# Altium schematic sheet 30-FT4232 LEVEL TRANSLATOR.SchDoc
size 513 x 386 mm
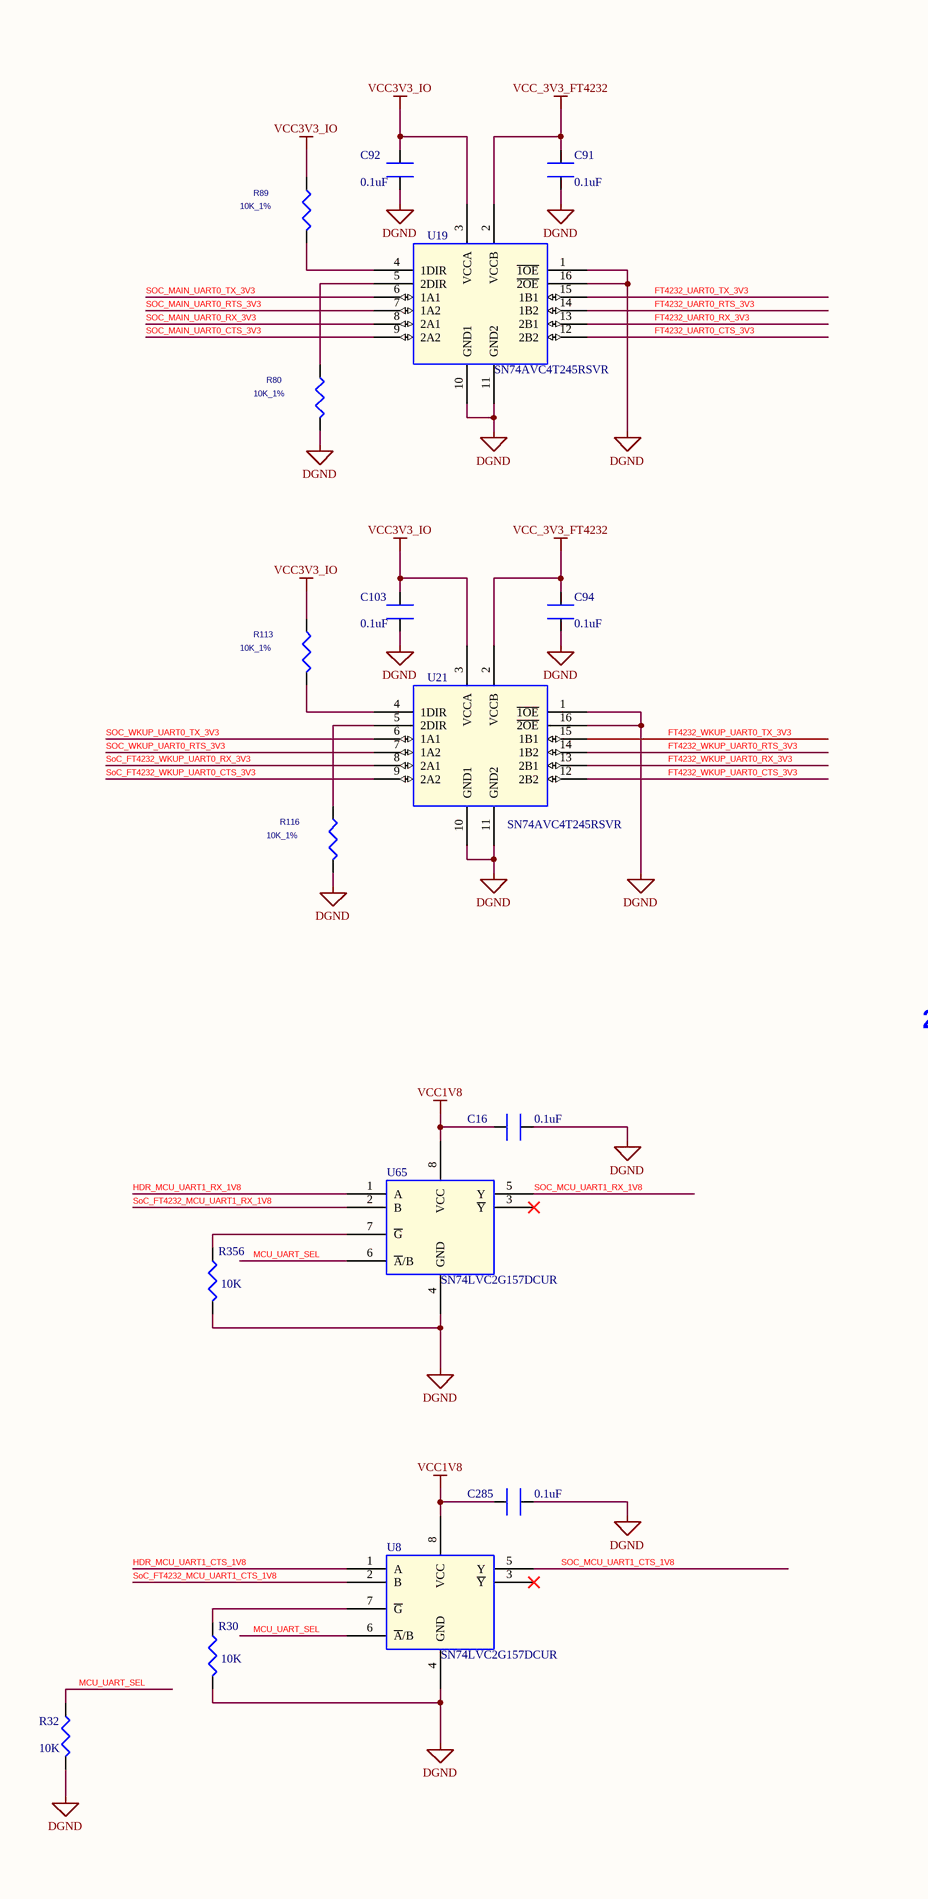
[diagram p0: 30-FT4232 LEVEL TRANSLATOR.SchDoc, left]
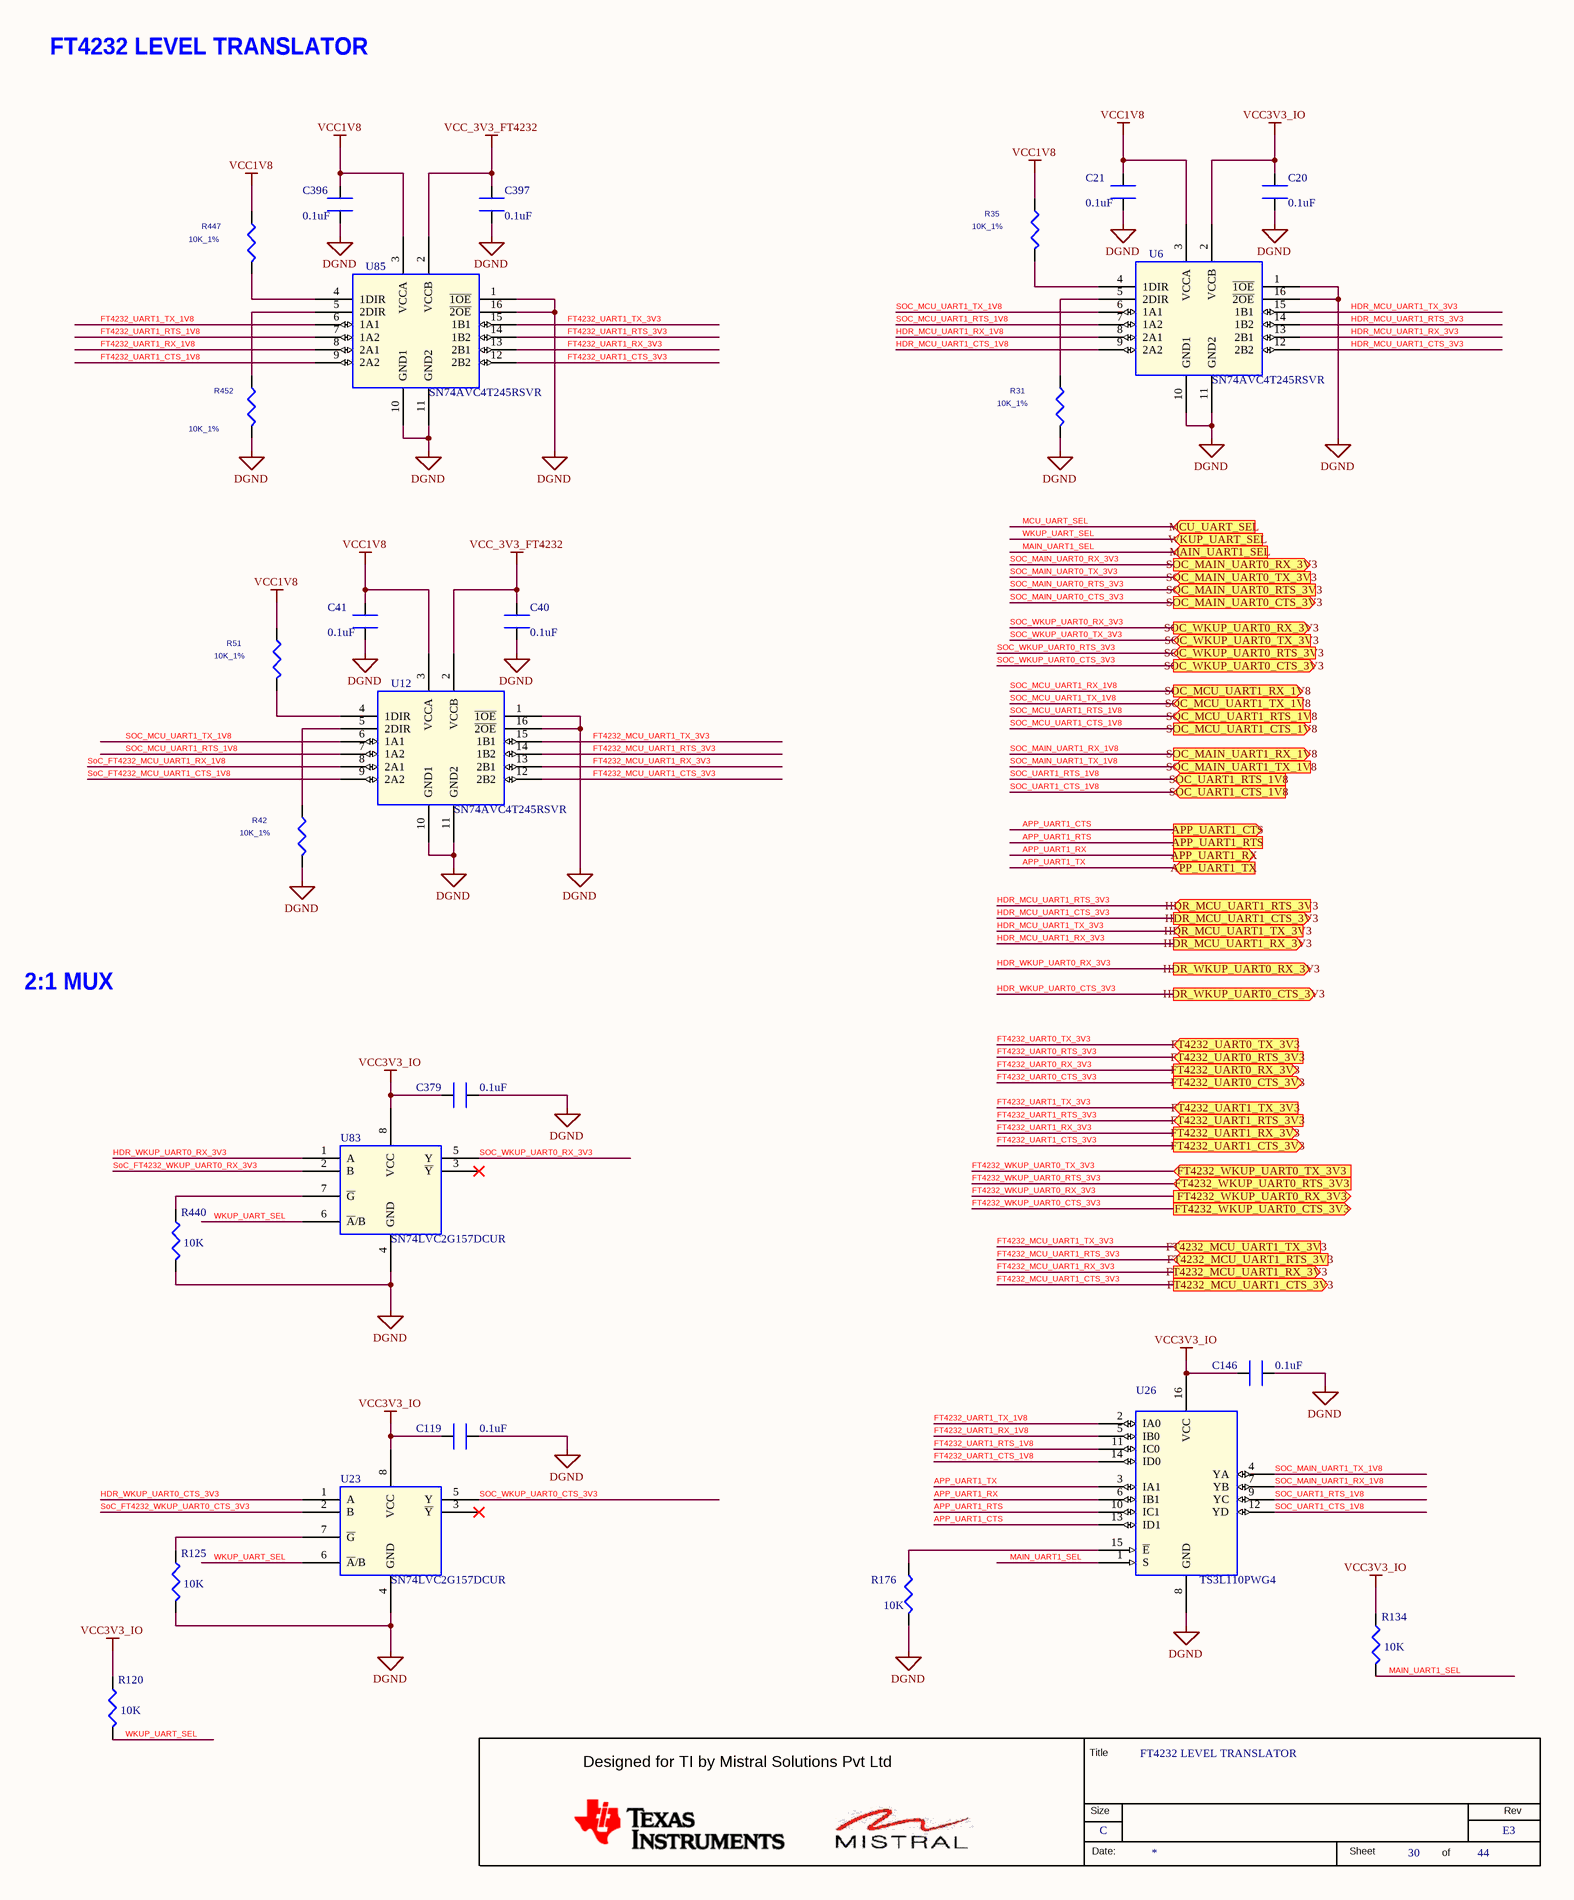
[diagram p1: 30-FT4232 LEVEL TRANSLATOR.SchDoc, right]

## Parts
*  RevCode: E3  Title: FT4232 LEVEL TRANSLATOR  Page Size: C  Page Number: 30  Page Count: 44  (hidden comment: MISTRAL_TITLEBLK_CSIZE)  (graphical)
C16  0.1uF  [CAP0201_0-5]
C20  0.1uF  [CAP0201_0-5]
C21  0.1uF  [CAP0201_0-5]
C40  0.1uF  [CAP0201_0-5]
C41  0.1uF  [CAP0201_0-5]
C91  0.1uF  [CAP0201_0-5]
C92  0.1uF  [CAP0201_0-5]
C94  0.1uF  [CAP0201_0-5]
C103  0.1uF  [CAP0201_0-5]
C119  0.1uF  [CAP0201_0-5]
C146  0.1uF  [CAP0201_0-5]
C285  0.1uF  [CAP0201_0-5]
C379  0.1uF  [CAP0201_0-5]
C396  0.1uF  [CAP0201_0-5]
C397  0.1uF  [CAP0201_0-5]
R30  10K  [RES0402_0-5]
R31  10K_1%  [RES0402_0-5]
R32  10K  [RES0402_0-5]
R35  10K_1%  [RES0402_0-5]
R42  10K_1%  [RES0402_0-5]
R51  10K_1%  [RES0402_0-5]
R80  10K_1%  [RES0402_0-5]
R89  10K_1%  [RES0402_0-5]
R113  10K_1%  [RES0402_0-5]
R116  10K_1%  [RES0402_0-5]
R120  10K  [RES0402_0-5]
R125  10K  [RES0402_0-5]
R134  10K  [RES0402_0-5]
R176  10K  [RES0402_0-5]
R356  10K  [RES0402_0-5]
R440  10K  [RES0402_0-5]
R447  10K_1%  [RES0402_0-5]
R452  10K_1%  [RES0402_0-5]
U6  SN74AVC4T245RSVR  [UQFN16_15-74_105X75_0-6]
U8  SN74LVC2G157DCUR  [VSSOP8_19-68_85X95_0-9]
U12  SN74AVC4T245RSVR  [UQFN16_15-74_105X75_0-6]
U19  SN74AVC4T245RSVR  [UQFN16_15-74_105X75_0-6]
U21  SN74AVC4T245RSVR  [UQFN16_15-74_105X75_0-6]
U23  SN74LVC2G157DCUR  [VSSOP8_19-68_85X95_0-9]
U26  TS3L110PWG4  [TSSOP16_25-59_205X180]
U65  SN74LVC2G157DCUR  [VSSOP8_19-68_85X95_0-9]
U83  SN74LVC2G157DCUR  [VSSOP8_19-68_85X95_0-9]
U85  SN74AVC4T245RSVR  [UQFN16_15-74_105X75_0-6]

## Ports
APP_UART1_CTS (out), APP_UART1_RTS, APP_UART1_RX (out), APP_UART1_TX (in), FT4232_MCU_UART1_CTS_3V3 (out), FT4232_MCU_UART1_RTS_3V3 (in), FT4232_MCU_UART1_RX_3V3 (out), FT4232_MCU_UART1_TX_3V3 (in), FT4232_UART0_CTS_3V3 (out), FT4232_UART0_RTS_3V3 (in), FT4232_UART0_RX_3V3 (out), FT4232_UART0_TX_3V3 (in), FT4232_UART1_CTS_3V3 (out), FT4232_UART1_RTS_3V3 (in), FT4232_UART1_RX_3V3 (out), FT4232_UART1_TX_3V3 (in), FT4232_WKUP_UART0_CTS_3V3 (out), FT4232_WKUP_UART0_RTS_3V3 (in), FT4232_WKUP_UART0_RX_3V3 (out), FT4232_WKUP_UART0_TX_3V3 (in), HDR_MCU_UART1_CTS_3V3 (out), HDR_MCU_UART1_RTS_3V3 (in), HDR_MCU_UART1_RX_3V3 (out), HDR_MCU_UART1_TX_3V3 (in), HDR_WKUP_UART0_CTS_3V3 (out), HDR_WKUP_UART0_RX_3V3 (out), MAIN_UART1_SEL (in), MCU_UART_SEL (in), SOC_MAIN_UART0_CTS_3V3 (out), SOC_MAIN_UART0_RTS_3V3 (in), SOC_MAIN_UART0_RX_3V3 (out), SOC_MAIN_UART0_TX_3V3 (in), SOC_MAIN_UART1_RX_1V8 (out), SOC_MAIN_UART1_TX_1V8 (in), SOC_MCU_UART1_CTS_1V8 (out), SOC_MCU_UART1_RTS_1V8 (in), SOC_MCU_UART1_RX_1V8 (out), SOC_MCU_UART1_TX_1V8 (in), SOC_UART1_CTS_1V8 (in), SOC_UART1_RTS_1V8 (in), SOC_WKUP_UART0_CTS_3V3 (out), SOC_WKUP_UART0_RTS_3V3 (in), SOC_WKUP_UART0_RX_3V3 (out), SOC_WKUP_UART0_TX_3V3 (in), WKUP_UART_SEL (in)

## Nets
DGND: C16.2 C20.2 C21.2 C40.2 C41.2 C91.2 C92.2 C94.2 C103.2 C119.2 C146.2 C285.2 C379.2 C396.2 C397.2 R30.2 R31.1 R32.2 R42.1 R80.1 R116.1 R125.2 R176.2 R356.2 R440.2 R452.1 U6.1(~{1OE}) U6.10(GND1) U6.11(GND2) U6.16(~{2OE}) U8.4(GND) U12.1(~{1OE}) U12.10(GND1) U12.11(GND2) U12.16(~{2OE}) U19.1(~{1OE}) U19.10(GND1) U19.11(GND2) U19.16(~{2OE}) U21.1(~{1OE}) U21.10(GND1) U21.11(GND2) U21.16(~{2OE}) U23.4(GND) U26.8(GND) U65.4(GND) U83.4(GND) U85.1(~{1OE}) U85.10(GND1) U85.11(GND2) U85.16(~{2OE})
VCC1V8: C16.1 C21.1 C41.1 C285.1 C396.1 R35.2 R51.2 R447.2 U6.3(VCCA) U8.8(VCC) U12.3(VCCA) U65.8(VCC) U85.3(VCCA)
VCC3V3_IO: C20.1 C92.1 C103.1 C119.1 C146.1 C379.1 R89.2 R113.2 R120.1 R134.1 U6.2(VCCB) U19.3(VCCA) U21.3(VCCA) U23.8(VCC) U26.16(VCC) U83.8(VCC)
VCC_3V3_FT4232: C40.1 C91.1 C94.1 C397.1 U12.2(VCCB) U19.2(VCCB) U21.2(VCCB) U85.2(VCCB)
APP_UART1_CTS: U26.13(ID1) ; port APP_UART1_CTS
APP_UART1_RTS: U26.10(IC1) ; port APP_UART1_RTS
APP_UART1_RX: U26.6(IB1) ; port APP_UART1_RX
APP_UART1_TX: U26.3(IA1) ; port APP_UART1_TX
FT4232_MCU_UART1_CTS_3V3: U12.12(2B2) ; port FT4232_MCU_UART1_CTS_3V3
FT4232_MCU_UART1_RTS_3V3: U12.14(1B2) ; port FT4232_MCU_UART1_RTS_3V3
FT4232_MCU_UART1_RX_3V3: U12.13(2B1) ; port FT4232_MCU_UART1_RX_3V3
FT4232_MCU_UART1_TX_3V3: U12.15(1B1) ; port FT4232_MCU_UART1_TX_3V3
FT4232_UART0_CTS_3V3: U19.12(2B2) ; port FT4232_UART0_CTS_3V3
FT4232_UART0_RTS_3V3: U19.14(1B2) ; port FT4232_UART0_RTS_3V3
FT4232_UART0_RX_3V3: U19.13(2B1) ; port FT4232_UART0_RX_3V3
FT4232_UART0_TX_3V3: U19.15(1B1) ; port FT4232_UART0_TX_3V3
FT4232_UART1_CTS_1V8: U26.14(ID0) U85.9(2A2)
FT4232_UART1_CTS_3V3: U85.12(2B2) ; port FT4232_UART1_CTS_3V3
FT4232_UART1_RTS_1V8: U26.11(IC0) U85.7(1A2)
FT4232_UART1_RTS_3V3: U85.14(1B2) ; port FT4232_UART1_RTS_3V3
FT4232_UART1_RX_1V8: U26.5(IB0) U85.8(2A1)
FT4232_UART1_RX_3V3: U85.13(2B1) ; port FT4232_UART1_RX_3V3
FT4232_UART1_TX_1V8: U26.2(IA0) U85.6(1A1)
FT4232_UART1_TX_3V3: U85.15(1B1) ; port FT4232_UART1_TX_3V3
FT4232_WKUP_UART0_CTS_3V3: U21.12(2B2) ; port FT4232_WKUP_UART0_CTS_3V3
FT4232_WKUP_UART0_RTS_3V3: U21.14(1B2) ; port FT4232_WKUP_UART0_RTS_3V3
FT4232_WKUP_UART0_RX_3V3: U21.13(2B1) ; port FT4232_WKUP_UART0_RX_3V3
FT4232_WKUP_UART0_TX_3V3: U21.15(1B1) ; port FT4232_WKUP_UART0_TX_3V3
HDR_MCU_UART1_CTS_1V8: U6.9(2A2) U8.1(A)
HDR_MCU_UART1_CTS_3V3: U6.12(2B2) ; port HDR_MCU_UART1_CTS_3V3
HDR_MCU_UART1_RTS_3V3: U6.14(1B2) ; port HDR_MCU_UART1_RTS_3V3
HDR_MCU_UART1_RX_1V8: U6.8(2A1) U65.1(A)
HDR_MCU_UART1_RX_3V3: U6.13(2B1) ; port HDR_MCU_UART1_RX_3V3
HDR_MCU_UART1_TX_3V3: U6.15(1B1) ; port HDR_MCU_UART1_TX_3V3
HDR_WKUP_UART0_CTS_3V3: U23.1(A) ; port HDR_WKUP_UART0_CTS_3V3
HDR_WKUP_UART0_RX_3V3: U83.1(A) ; port HDR_WKUP_UART0_RX_3V3
MAIN_UART1_SEL: R134.2 U26.1(S) ; port MAIN_UART1_SEL
MCU_UART_SEL: R32.1 U8.6(~{A}/B) U65.6(~{A}/B) ; port MCU_UART_SEL
SoC_FT4232_MCU_UART1_CTS_1V8: U8.2(B) U12.9(2A2)
SoC_FT4232_MCU_UART1_RX_1V8: U12.8(2A1) U65.2(B)
SoC_FT4232_WKUP_UART0_CTS_3V3: U21.9(2A2) U23.2(B)
SoC_FT4232_WKUP_UART0_RX_3V3: U21.8(2A1) U83.2(B)
SOC_MAIN_UART0_CTS_3V3: U19.9(2A2) ; port SOC_MAIN_UART0_CTS_3V3
SOC_MAIN_UART0_RTS_3V3: U19.7(1A2) ; port SOC_MAIN_UART0_RTS_3V3
SOC_MAIN_UART0_RX_3V3: U19.8(2A1) ; port SOC_MAIN_UART0_RX_3V3
SOC_MAIN_UART0_TX_3V3: U19.6(1A1) ; port SOC_MAIN_UART0_TX_3V3
SOC_MAIN_UART1_RX_1V8: U26.7(YB) ; port SOC_MAIN_UART1_RX_1V8
SOC_MAIN_UART1_TX_1V8: U26.4(YA) ; port SOC_MAIN_UART1_TX_1V8
SOC_MCU_UART1_CTS_1V8: U8.5(Y) ; port SOC_MCU_UART1_CTS_1V8
SOC_MCU_UART1_RTS_1V8: U6.7(1A2) U12.7(1A2) ; port SOC_MCU_UART1_RTS_1V8
SOC_MCU_UART1_RX_1V8: U65.5(Y) ; port SOC_MCU_UART1_RX_1V8
SOC_MCU_UART1_TX_1V8: U6.6(1A1) U12.6(1A1) ; port SOC_MCU_UART1_TX_1V8
SOC_UART1_CTS_1V8: U26.12(YD) ; port SOC_UART1_CTS_1V8
SOC_UART1_RTS_1V8: U26.9(YC) ; port SOC_UART1_RTS_1V8
SOC_WKUP_UART0_CTS_3V3: U23.5(Y) ; port SOC_WKUP_UART0_CTS_3V3
SOC_WKUP_UART0_RTS_3V3: U21.7(1A2) ; port SOC_WKUP_UART0_RTS_3V3
SOC_WKUP_UART0_RX_3V3: U83.5(Y) ; port SOC_WKUP_UART0_RX_3V3
SOC_WKUP_UART0_TX_3V3: U21.6(1A1) ; port SOC_WKUP_UART0_TX_3V3
WKUP_UART_SEL: R120.2 U23.6(~{A}/B) U83.6(~{A}/B) ; port WKUP_UART_SEL
NetR30_1: R30.1 U8.7(~{G})
NetR31_2: R31.2 U6.5(2DIR)
NetR35_1: R35.1 U6.4(1DIR)
NetR42_2: R42.2 U12.5(2DIR)
NetR51_1: R51.1 U12.4(1DIR)
NetR80_2: R80.2 U19.5(2DIR)
NetR89_1: R89.1 U19.4(1DIR)
NetR113_1: R113.1 U21.4(1DIR)
NetR116_2: R116.2 U21.5(2DIR)
NetR125_1: R125.1 U23.7(~{G})
NetR176_1: R176.1 U26.15(~{E})
NetR356_1: R356.1 U65.7(~{G})
NetR440_1: R440.1 U83.7(~{G})
NetR447_1: R447.1 U85.4(1DIR)
NetR452_2: R452.2 U85.5(2DIR)

Not connected (* = marked no-connect by the designer): U8 3(~{Y})*; U23 3(~{Y})*; U65 3(~{Y})*; U83 3(~{Y})*

## Notes on the sheet
- FT4232 LEVEL TRANSLATOR
- 2:1 MUX
- (in symbol MISTRAL_TITLEBLK_CSIZE) Title; Designed for TI by Mistral Solutions Pvt Ltd; Size; Rev; Date:; Sheet; of

## Library data of the parts
* = MISTRAL_TITLEBLK_CSIZE: Issue: 1.0; Page Create Date: March  8, 1995; Page Modify Date: *
C16 C21 C146 C379 = CAP_Dup3: CAP CERAMIC 0.1uF 16V 10% X5R 0201; Mistral Part No: 120009030072-R; Mfr_name: MURATA; Mfr_part_number: GRM033R61C104KE84J; Part_type: CAPACITORS\CERAMIC; Project: TI_MAXIE_CPB; Customs_HS_Code: 85322990; Custom_Duty: 15%; Wattage: NA; Library Ref: CAP; PCB Footprint: CAP0201_0-5; Tolerance: 10%; Voltage: 16V; Package: 0201; Distributor_name: DIGIKEY; Distributor_part_number: 490-16742-1-ND; Height: 0.33MM; Datasheet: Y:\MIS_DATABASE\DATASHEETS\CAPACITORS\GRM033R61C104KE84.PDF; Crtd /date: MANIRAJA/120218; Chkd/date: MANIRAJA/120218; Weight: 0.33mg; Temperature: -55°C+85°C; MECHANICAL 3D STEP FILE: CAP0201_0-5
C20 = CAP_Dup3: CAP CERAMIC 0.1uF 16V 10% X5R 0201; Part_type: CAPACITORS\CERAMIC; Mfr_part_number: GRM033R61C104KE84J; Mfr_name: MURATA; Mistral Part No: 120009030072-R; Custom_Duty: 15%; Customs_HS_Code: 85322990; Project: TI_MAXIE_CPB; Wattage: NA; Library Ref: CAP; PCB Footprint: CAP0201_0-5; Chkd/date: MANIRAJA/120218; Crtd /date: MANIRAJA/120218; Datasheet: Y:\MIS_DATABASE\DATASHEETS\CAPACITORS\GRM033R61C104KE84.PDF; Height: 0.33MM; Distributor_part_number: 490-16742-1-ND; Distributor_name: DIGIKEY; Package: 0201; Voltage: 16V; Tolerance: 10%; Weight: 0.33mg; Temperature: -55°C+85°C; MECHANICAL 3D STEP FILE: CAP0201_0-5
C40 C92 C103 C119 C285 C396 = CAP_Dup3: CAP CERAMIC 0.1uF 16V 10% X5R 0201; Part_type: CAPACITORS\CERAMIC; Mfr_part_number: GRM033R61C104KE84J; Mfr_name: MURATA; Mistral Part No: 120009030072-R; Wattage: NA; Custom_Duty: 15%; Customs_HS_Code: 85322990; Project: TI_MAXIE_CPB; Library Ref: CAP; PCB Footprint: CAP0201_0-5; MECHANICAL 3D STEP FILE: CAP0201_0-5; Temperature: -55°C+85°C; Weight: 0.33mg; Chkd/date: MANIRAJA/120218; Crtd /date: MANIRAJA/120218; Datasheet: Y:\MIS_DATABASE\DATASHEETS\CAPACITORS\GRM033R61C104KE84.PDF; Height: 0.33MM; Distributor_part_number: 490-16742-1-ND; Distributor_name: DIGIKEY; Package: 0201; Voltage: 16V; Tolerance: 10%
C41 C91 C94 C397 = CAP_Dup3: CAP CERAMIC 0.1uF 16V 10% X5R 0201; Mistral Part No: 120009030072-R; Mfr_name: MURATA; Mfr_part_number: GRM033R61C104KE84J; Part_type: CAPACITORS\CERAMIC; Wattage: NA; Project: TI_MAXIE_CPB; Customs_HS_Code: 85322990; Custom_Duty: 15%; Library Ref: CAP; PCB Footprint: CAP0201_0-5; MECHANICAL 3D STEP FILE: CAP0201_0-5; Temperature: -55°C+85°C; Weight: 0.33mg; Tolerance: 10%; Voltage: 16V; Package: 0201; Distributor_name: DIGIKEY; Distributor_part_number: 490-16742-1-ND; Height: 0.33MM; Datasheet: Y:\MIS_DATABASE\DATASHEETS\CAPACITORS\GRM033R61C104KE84.PDF; Crtd /date: MANIRAJA/120218; Chkd/date: MANIRAJA/120218
R30 R32 R125 R134 = RESISTOR_Dup5: RES 10K 1/16W 5% 0402; Mistral Part No: 110009030208-R; Mfr_name: YAGEO AMERICA; Mfr_part_number: RC0402JR-0710KL; Part_type: RESISTORS\FIXED; Project: HSE; Voltage: NA; Customs_HS_Code: 85332119; Custom_Duty: 15%; Footprint Path: Y:\MIS_DATABASE\Library\ALTIUM_TOOL\PCB_FOOTPRINTS\Altium_Footprint_Lib.PcbLib; Library Path: Y:\MIS_DATABASE\Library\ALTIUM_TOOL\SCHEMATICS_PARTS\MS_DISCRETE_Library.schlib; Footprint Ref: RES0402_0-5; Library Ref: RESISTOR; PCB Footprint: RES0402_0-5; Tolerance: 5%; Wattage: 1/16W; Package: 0402; Distributor_name: DIGIKEY; Distributor_part_number: 311-10KJRCT-ND; Height: 0.40MM; Weight: 0.65mg; Temperature: -55°C+155°C; Datasheet: Y:\MIS_DATABASE\DATASHEETS\RESISTORS\YAGEO-RC0402.PDF; Crtd /date: MAZHAR/230805; Chkd/date: VASANTHA/061216; RoHS: Pb-Free; MECHANICAL 3D STEP FILE: RES0402_0-5
R31 R35 R452 = RESISTOR_Dup2: RES 10K 1/16W 1% 0402; Part_type: RESISTORS\FIXED; Mfr_part_number: RC0402FR-0710KL; Mfr_name: YAGEO AMERICA; Mistral Part No: 110009030220-P; Custom_Duty: 15%; Customs_HS_Code: 85332119; Project: VOCERA; Voltage: NA; Footprint Path: Y:\MIS_DATABASE\Library\ALTIUM_TOOL\PCB_FOOTPRINTS\Altium_Footprint_Lib.PcbLib; Library Path: Y:\MIS_DATABASE\Library\ALTIUM_TOOL\SCHEMATICS_PARTS\MS_DISCRETE_Library.schlib; Footprint Ref: RES0402_0-5; Library Ref: RESISTOR; PCB Footprint: RES0402_0-5; RoHS: Pb-Free; Chkd/date: VASANTHA/201216; Crtd /date: GEETHA/290506; Datasheet: Y:\MIS_DATABASE\DATASHEETS\RESISTORS\YAGEO-RC0402.PDF; Height: 0.40MM; Distributor_part_number: 311-10.0KLRTR-ND; Distributor_name: DIGIKEY; Package: 0402; Wattage: 1/16W; Tolerance: 1%; Weight: 0.65mg; Temperature: -55°C+155°C; MECHANICAL 3D STEP FILE: RES0402_0-5
R42 R51 R80 = RESISTOR_Dup2: RES 10K 1/16W 1% 0402; Part_type: RESISTORS\FIXED; Mfr_part_number: RC0402FR-0710KL; Mfr_name: YAGEO AMERICA; Mistral Part No: 110009030220-P; Voltage: NA; Custom_Duty: 15%; Customs_HS_Code: 85332119; Project: VOCERA; Footprint Path: Y:\MIS_DATABASE\Library\ALTIUM_TOOL\PCB_FOOTPRINTS\Altium_Footprint_Lib.PcbLib; Library Path: Y:\MIS_DATABASE\Library\ALTIUM_TOOL\SCHEMATICS_PARTS\MS_DISCRETE_Library.schlib; Footprint Ref: RES0402_0-5; Library Ref: RESISTOR; PCB Footprint: RES0402_0-5; MECHANICAL 3D STEP FILE: RES0402_0-5; Temperature: -55°C+155°C; Weight: 0.65mg; RoHS: Pb-Free; Chkd/date: VASANTHA/201216; Crtd /date: GEETHA/290506; Datasheet: Y:\MIS_DATABASE\DATASHEETS\RESISTORS\YAGEO-RC0402.PDF; Height: 0.40MM; Distributor_part_number: 311-10.0KLRTR-ND; Distributor_name: DIGIKEY; Package: 0402; Wattage: 1/16W; Tolerance: 1%
R89 R113 R116 R447 = RESISTOR_Dup2: RES 10K 1/16W 1% 0402; Mistral Part No: 110009030220-P; Mfr_name: YAGEO AMERICA; Mfr_part_number: RC0402FR-0710KL; Part_type: RESISTORS\FIXED; Voltage: NA; Project: VOCERA; Customs_HS_Code: 85332119; Custom_Duty: 15%; Footprint Path: Y:\MIS_DATABASE\Library\ALTIUM_TOOL\PCB_FOOTPRINTS\Altium_Footprint_Lib.PcbLib; Library Path: Y:\MIS_DATABASE\Library\ALTIUM_TOOL\SCHEMATICS_PARTS\MS_DISCRETE_Library.schlib; Footprint Ref: RES0402_0-5; Library Ref: RESISTOR; PCB Footprint: RES0402_0-5; MECHANICAL 3D STEP FILE: RES0402_0-5; Temperature: -55°C+155°C; Weight: 0.65mg; Tolerance: 1%; Wattage: 1/16W; Package: 0402; Distributor_name: DIGIKEY; Distributor_part_number: 311-10.0KLRTR-ND; Height: 0.40MM; Datasheet: Y:\MIS_DATABASE\DATASHEETS\RESISTORS\YAGEO-RC0402.PDF; Crtd /date: GEETHA/290506; Chkd/date: VASANTHA/201216; RoHS: Pb-Free
R120 R176 R356 R440 = RESISTOR_Dup5: RES 10K 1/16W 5% 0402; Part_type: RESISTORS\FIXED; Mfr_part_number: RC0402JR-0710KL; Mfr_name: YAGEO AMERICA; Mistral Part No: 110009030208-R; Custom_Duty: 15%; Customs_HS_Code: 85332119; Voltage: NA; Project: HSE; Footprint Path: Y:\MIS_DATABASE\Library\ALTIUM_TOOL\PCB_FOOTPRINTS\Altium_Footprint_Lib.PcbLib; Library Path: Y:\MIS_DATABASE\Library\ALTIUM_TOOL\SCHEMATICS_PARTS\MS_DISCRETE_Library.schlib; Footprint Ref: RES0402_0-5; Library Ref: RESISTOR; PCB Footprint: RES0402_0-5; MECHANICAL 3D STEP FILE: RES0402_0-5; RoHS: Pb-Free; Chkd/date: VASANTHA/061216; Crtd /date: MAZHAR/230805; Datasheet: Y:\MIS_DATABASE\DATASHEETS\RESISTORS\YAGEO-RC0402.PDF; Temperature: -55°C+155°C; Weight: 0.65mg; Height: 0.40MM; Distributor_part_number: 311-10KJRCT-ND; Distributor_name: DIGIKEY; Package: 0402; Wattage: 1/16W; Tolerance: 5%
U6 U12 U21 = SN74AVC4T245RSV_UQFN16: IC BUS TRANSCEIVER 4-BIT DUAL SUPPLY QFN16; Mistral Part No: 141011040011-R; Mfr_name: TEXAS INSTRUMENTS; Part_type: ICS\DIGITAL\BUSTRANSCEIVER; Project: HMC; Tolerance: NA; Customs_HS_Code: 85423100; Custom_Duty: 15%; Library Ref: SN74AVC4T245RSV_UQFN16; PCB Footprint: UQFN16_15-74_105X75_0-6; Mfr_part_number: SN74AVC4T245RSVR; Voltage: NA; Wattage: NA; Package: QFN16; Distributor_name: DIGIKEY; Distributor_part_number: 296-24366-1-ND; Height: 0.55MM; Weight: NA; Temperature: -40°C+85°C; Datasheet: Y:\MIS_DATABASE\DATASHEETS\ICS\DIGITAL\BUSTRANSCEIVER\SN74AVC4T245XXXX.PDF; Crtd /date: BAVISH/190411; Chkd/date: VASANTHA/221216; MECHANICAL 3D STEP FILE: UQFN16_15-74_105X75_0-6
U8 U83 = SN74LVC2G157DCUR_VSSOP8: IC 2-LINE TO 1-LINE DATA SELECTOR MULTIPLEXER VSSOP8; Part_type: ICS\DIGITAL\COMBINATIONAL; Mfr_name: TEXAS INSTRUMENTS; Mistral Part No: 141017090014-R; Custom_Duty: 15%; Customs_HS_Code: 85423100; Wattage: NA; Project: TI_MAXIE_CPB; Library Ref: SN74LVC2G157DCUR_VSSOP8; PCB Footprint: VSSOP8_19-68_85X95_0-9; MECHANICAL 3D STEP FILE: VSSOP8_19-68_85X95_0-9; Chkd/date: MANIRAJA/120917; Crtd /date: MANIRAJA/120917; Datasheet: Y:\MIS_DATABASE\DATASHEETS\ICS\DIGITAL\COMBINATIONAL\SN74LVC2G157.PDF; Temperature: -40°C+85°C; Weight: 9.6mg; Height: 0.90MM; Distributor_part_number: 296-12605-1-ND; Distributor_name: DIGIKEY; Package: VSSOP8; Voltage: NA; Tolerance: NA; Mfr_part_number: SN74LVC2G157DCUR
U19 U85 = SN74AVC4T245RSV_UQFN16: IC BUS TRANSCEIVER 4-BIT DUAL SUPPLY QFN16; Part_type: ICS\DIGITAL\BUSTRANSCEIVER; Mfr_name: TEXAS INSTRUMENTS; Mistral Part No: 141011040011-R; Custom_Duty: 15%; Customs_HS_Code: 85423100; Wattage: NA; Project: HMC; PCB Footprint: UQFN16_15-74_105X75_0-6; MECHANICAL 3D STEP FILE: UQFN16_15-74_105X75_0-6; Chkd/date: VASANTHA/221216; Crtd /date: BAVISH/190411; Datasheet: Y:\MIS_DATABASE\DATASHEETS\ICS\DIGITAL\BUSTRANSCEIVER\SN74AVC4T245XXXX.PDF; Temperature: -40°C+85°C; Weight: NA; Height: 0.55MM; Distributor_part_number: 296-24366-1-ND; Distributor_name: DIGIKEY; Package: QFN16; Voltage: NA; Tolerance: NA; Mfr_part_number: SN74AVC4T245RSVR; Library Ref: SN74AVC4T245RSV_UQFN16
U23 U65 = SN74LVC2G157DCUR_VSSOP8: IC 2-LINE TO 1-LINE DATA SELECTOR MULTIPLEXER VSSOP8; Mistral Part No: 141017090014-R; Mfr_name: TEXAS INSTRUMENTS; Part_type: ICS\DIGITAL\COMBINATIONAL; Project: TI_MAXIE_CPB; Tolerance: NA; Customs_HS_Code: 85423100; Custom_Duty: 15%; Library Ref: SN74LVC2G157DCUR_VSSOP8; PCB Footprint: VSSOP8_19-68_85X95_0-9; Mfr_part_number: SN74LVC2G157DCUR; Voltage: NA; Wattage: NA; Package: VSSOP8; Distributor_name: DIGIKEY; Distributor_part_number: 296-12605-1-ND; Height: 0.90MM; Weight: 9.6mg; Temperature: -40°C+85°C; Datasheet: Y:\MIS_DATABASE\DATASHEETS\ICS\DIGITAL\COMBINATIONAL\SN74LVC2G157.PDF; Crtd /date: MANIRAJA/120917; Chkd/date: MANIRAJA/120917; MECHANICAL 3D STEP FILE: VSSOP8_19-68_85X95_0-9
U26 = TS3L110PWG4_TSSOP16: IC QUAD SPDT SWITCH 8-4 CHANNEL MULTIPLEXER/DEMULTIPLEXER TSSOP16; Mistral Part No: 140114110002-R; Mfr_name: TEXAS INSTRUMENTS; Part_type: ICS\ANALOG\APPLICATION SPECIFIC; Project: GALILEO EVM; Tolerance: NA; Customs_HS_Code: 85369090; Custom_Duty: 15%; Library Ref: TS3L110PWG4_TSSOP16; PCB Footprint: TSSOP16_25-59_205X180; Mfr_part_number: TS3L110PWG4; Voltage: NA; Wattage: NA; Package: TSSOP16; Distributor_name: DIGIKEY; Distributor_part_number: TS3L110PWG4-ND; Height: 1.20MM; Weight: NA; Temperature: -40°C+85°C; Datasheet: Y:\MIS_DATABASE\DATASHEETS\ICS\DIGITAL\COMBINATIONAL\TS3L110_SERIES.PDF; Crtd /date: JEBRAN/051114; Chkd/date: NAVEED/060115